# EAGLE schematic SmartSoilSensor (EAGLE 9.5.0)
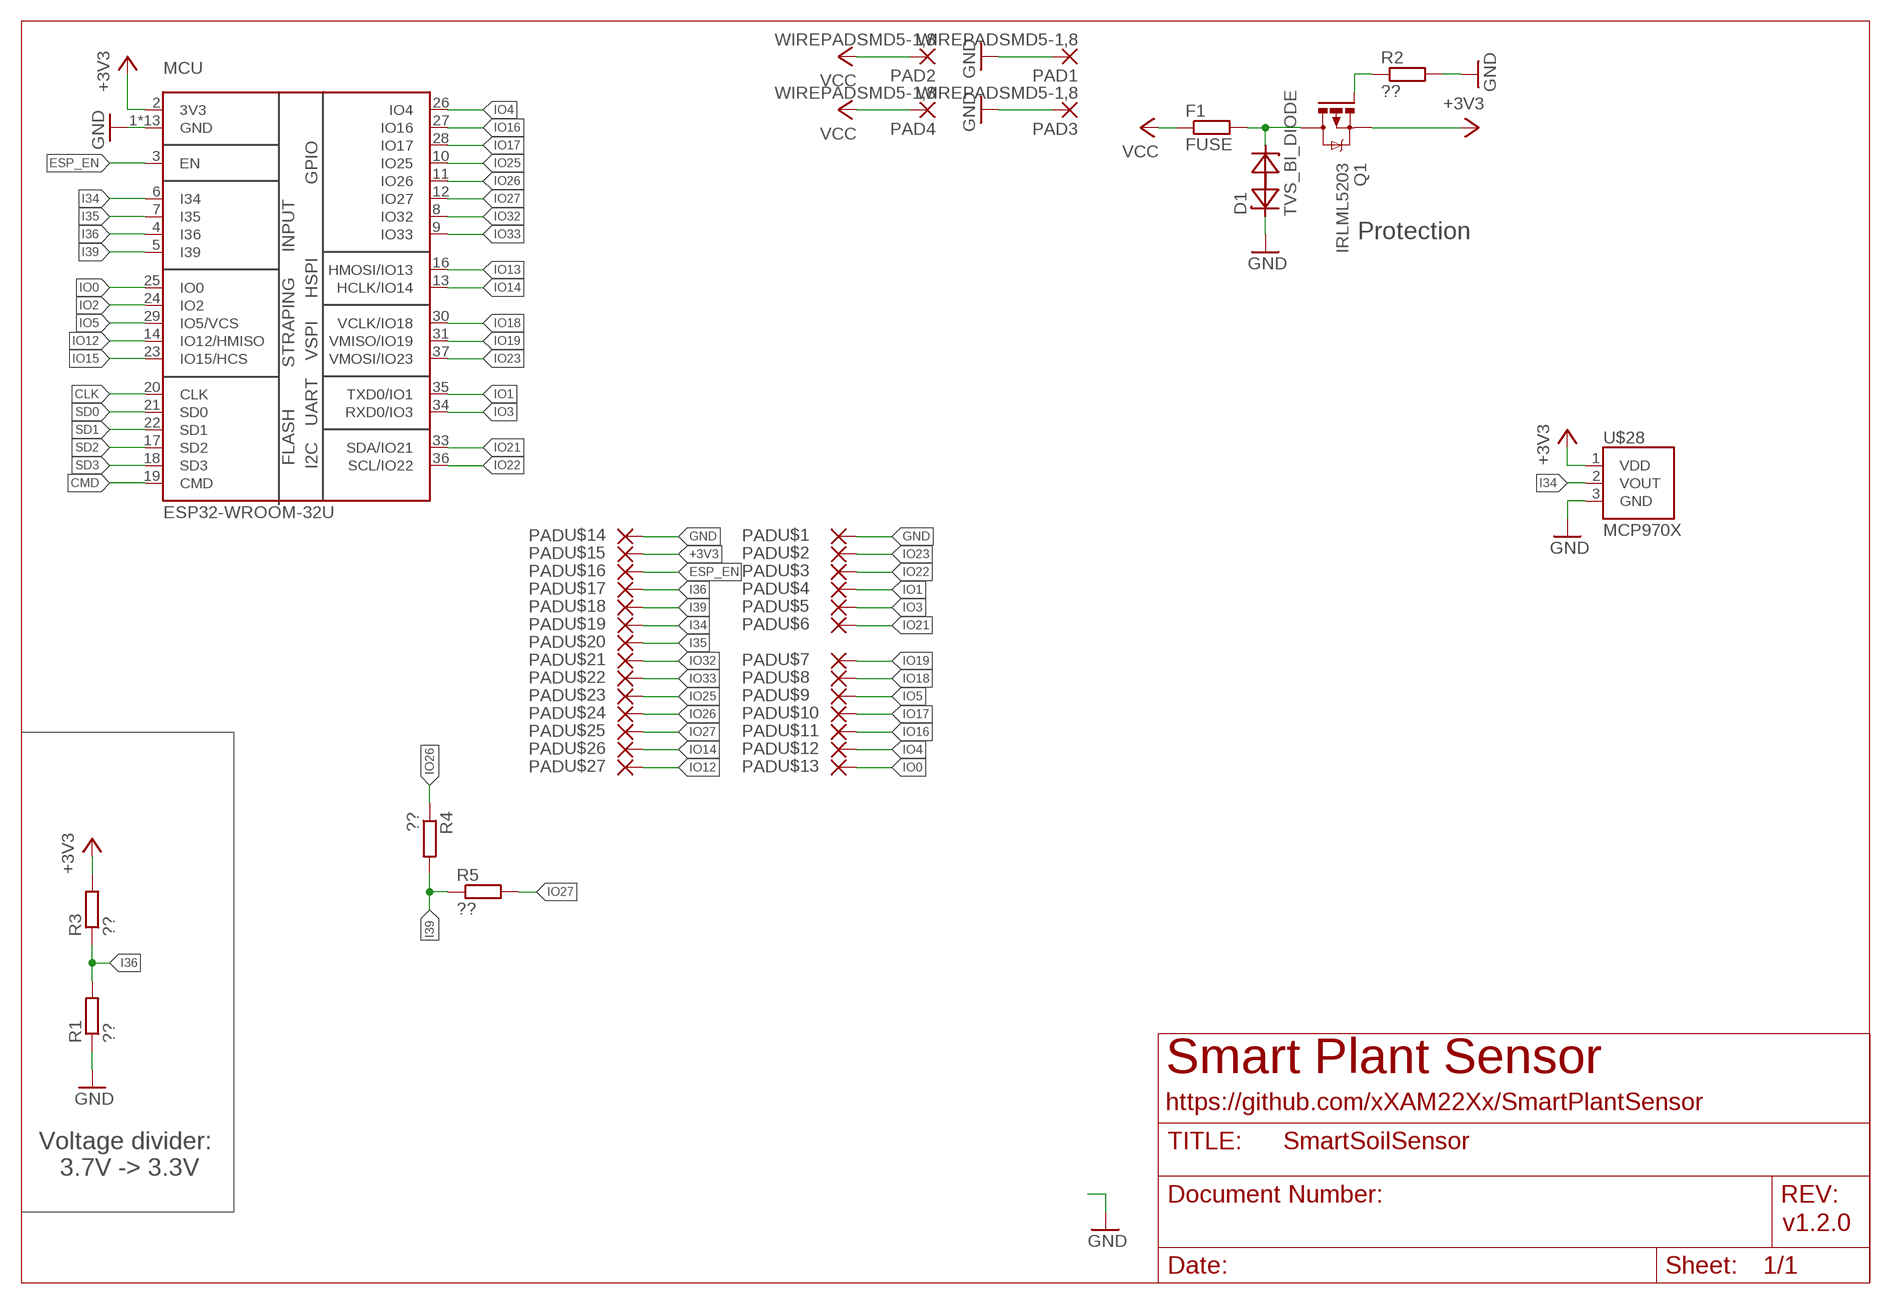
[diagram p0: schematic, sheet 1]

## Parts
D1  TVS_BI_DIODE  [R0603]
F1  FUSE  R-EU_R1206  [R1206]
MCU  ESP32-WROOM-32U  [ESP32-WROOM-32U]
PAD1  WIREPADSMD5-1,8  [5-1,8]
PAD2  WIREPADSMD5-1,8  [5-1,8]
PAD3  WIREPADSMD5-1,8  [5-1,8]
PAD4  WIREPADSMD5-1,8  [5-1,8]
Q1  IRLML5203  [MICRO3]
R1  ??  R-EU_R0603  [R0603]
R2  ??  R-EU_R0603  [R0603]
R3  ??  R-EU_R0603  [R0603]
R4  ??  R-EU_R0603  [R0603]
R5  ??  R-EU_R0603  [R0603]
U$1  PAD  [PAD]
U$2  PAD  [PAD]
U$3  PAD  [PAD]
U$4  PAD  [PAD]
U$5  PAD  [PAD]
U$6  PAD  [PAD]
U$7  PAD  [PAD]
U$8  PAD  [PAD]
U$9  PAD  [PAD]
U$10  PAD  [PAD]
U$11  PAD  [PAD]
U$12  PAD  [PAD]
U$13  PAD  [PAD]
U$14  PAD  [PAD]
U$15  PAD  [PAD]
U$16  PAD  [PAD]
U$17  PAD  [PAD]
U$18  PAD  [PAD]
U$19  PAD  [PAD]
U$20  PAD  [PAD]
U$21  PAD  [PAD]
U$22  PAD  [PAD]
U$23  PAD  [PAD]
U$24  PAD  [PAD]
U$25  PAD  [PAD]
U$26  PAD  [PAD]
U$27  PAD  [PAD]
U$28  MCP970X  [MCP970X]

## Nets
+3V3: MCU.2(3V3) Q1.2(S) R3.2 U$15.P$1(P) U$28.1(VDD)
CLK: MCU.20(CLK)
CMD: MCU.19(CMD)
ESP_EN: MCU.3(EN) U$16.P$1(P)
GND: D1.1(A) MCU.1(GND) MCU.15(GND) MCU.38(GND) MCU.39(GND) MCU.P$1(GND) MCU.P$2(GND) MCU.P$3(GND) MCU.P$4(GND) MCU.P$5(GND) MCU.P$6(GND) MCU.P$7(GND) MCU.P$8(GND) MCU.P$9(GND) PAD1.1(P) PAD3.1(P) R1.1 R2.2 U$1.P$1(P) U$14.P$1(P) U$28.3(GND)
I34: MCU.6(I34) U$19.P$1(P) U$28.2(VOUT)
I35: MCU.7(I35) U$20.P$1(P)
I36: MCU.4(I36) R1.2 R3.1 U$17.P$1(P)
I39: MCU.5(I39) R4.2 R5.1 U$18.P$1(P)
IO0: MCU.25(IO0) U$13.P$1(P)
IO1: MCU.35(TXD0/IO1) U$4.P$1(P)
IO2: MCU.24(IO2)
IO3: MCU.34(RXD0/IO3) U$5.P$1(P)
IO4: MCU.26(IO4) U$12.P$1(P)
IO5: MCU.29(IO5/VCS) U$9.P$1(P)
IO12: MCU.14(IO12/HMISO) U$27.P$1(P)
IO13: MCU.16(HMOSI/IO13)
IO14: MCU.13(HCLK/IO14) U$26.P$1(P)
IO15: MCU.23(IO15/HCS)
IO16: MCU.27(IO16) U$11.P$1(P)
IO17: MCU.28(IO17) U$10.P$1(P)
IO18: MCU.30(VCLK/IO18) U$8.P$1(P)
IO19: MCU.31(VMISO/IO19) U$7.P$1(P)
IO21: MCU.33(SDA/IO21) U$6.P$1(P)
IO22: MCU.36(SCL/IO22) U$3.P$1(P)
IO23: MCU.37(VMOSI/IO23) U$2.P$1(P)
IO25: MCU.10(IO25) U$23.P$1(P)
IO26: MCU.11(IO26) R4.1 U$24.P$1(P)
IO27: MCU.12(IO27) R5.2 U$25.P$1(P)
IO32: MCU.8(IO32) U$21.P$1(P)
IO33: MCU.9(IO33) U$22.P$1(P)
N$1: D1.2(C) F1.2 Q1.3(D)
N$2: Q1.1(G) R2.1
SD0: MCU.21(SD0)
SD1: MCU.22(SD1)
SD2: MCU.17(SD2)
SD3: MCU.18(SD3)
VCC: F1.1 PAD2.1(P) PAD4.1(P)

## Notes on the sheet
- Protection
- Smart Plant Sensor
- https://github.com/xXAM22Xx/SmartPlantSensor
- Voltage divider:
     3.7V -> 3.3V
- v1.2.0

## Library data of the parts
D1 = HeRo:TVS_BI_DIODE
F1 R1-R5 = rcl:R-EU_: RESISTOR, European symbol; SPICEPREFIX: R
MCU = ESP:ESP32-WROOM-32U
PAD1-PAD4 = wirepad:WIREPAD: Wire PAD connect wire on PCB
Q1 = transistor-power:IRLML5203: HEXFET P-Channel Power MOSFET
U$1-U$27 = IMSL:PAD
U$28 = IMSL:MCP970X